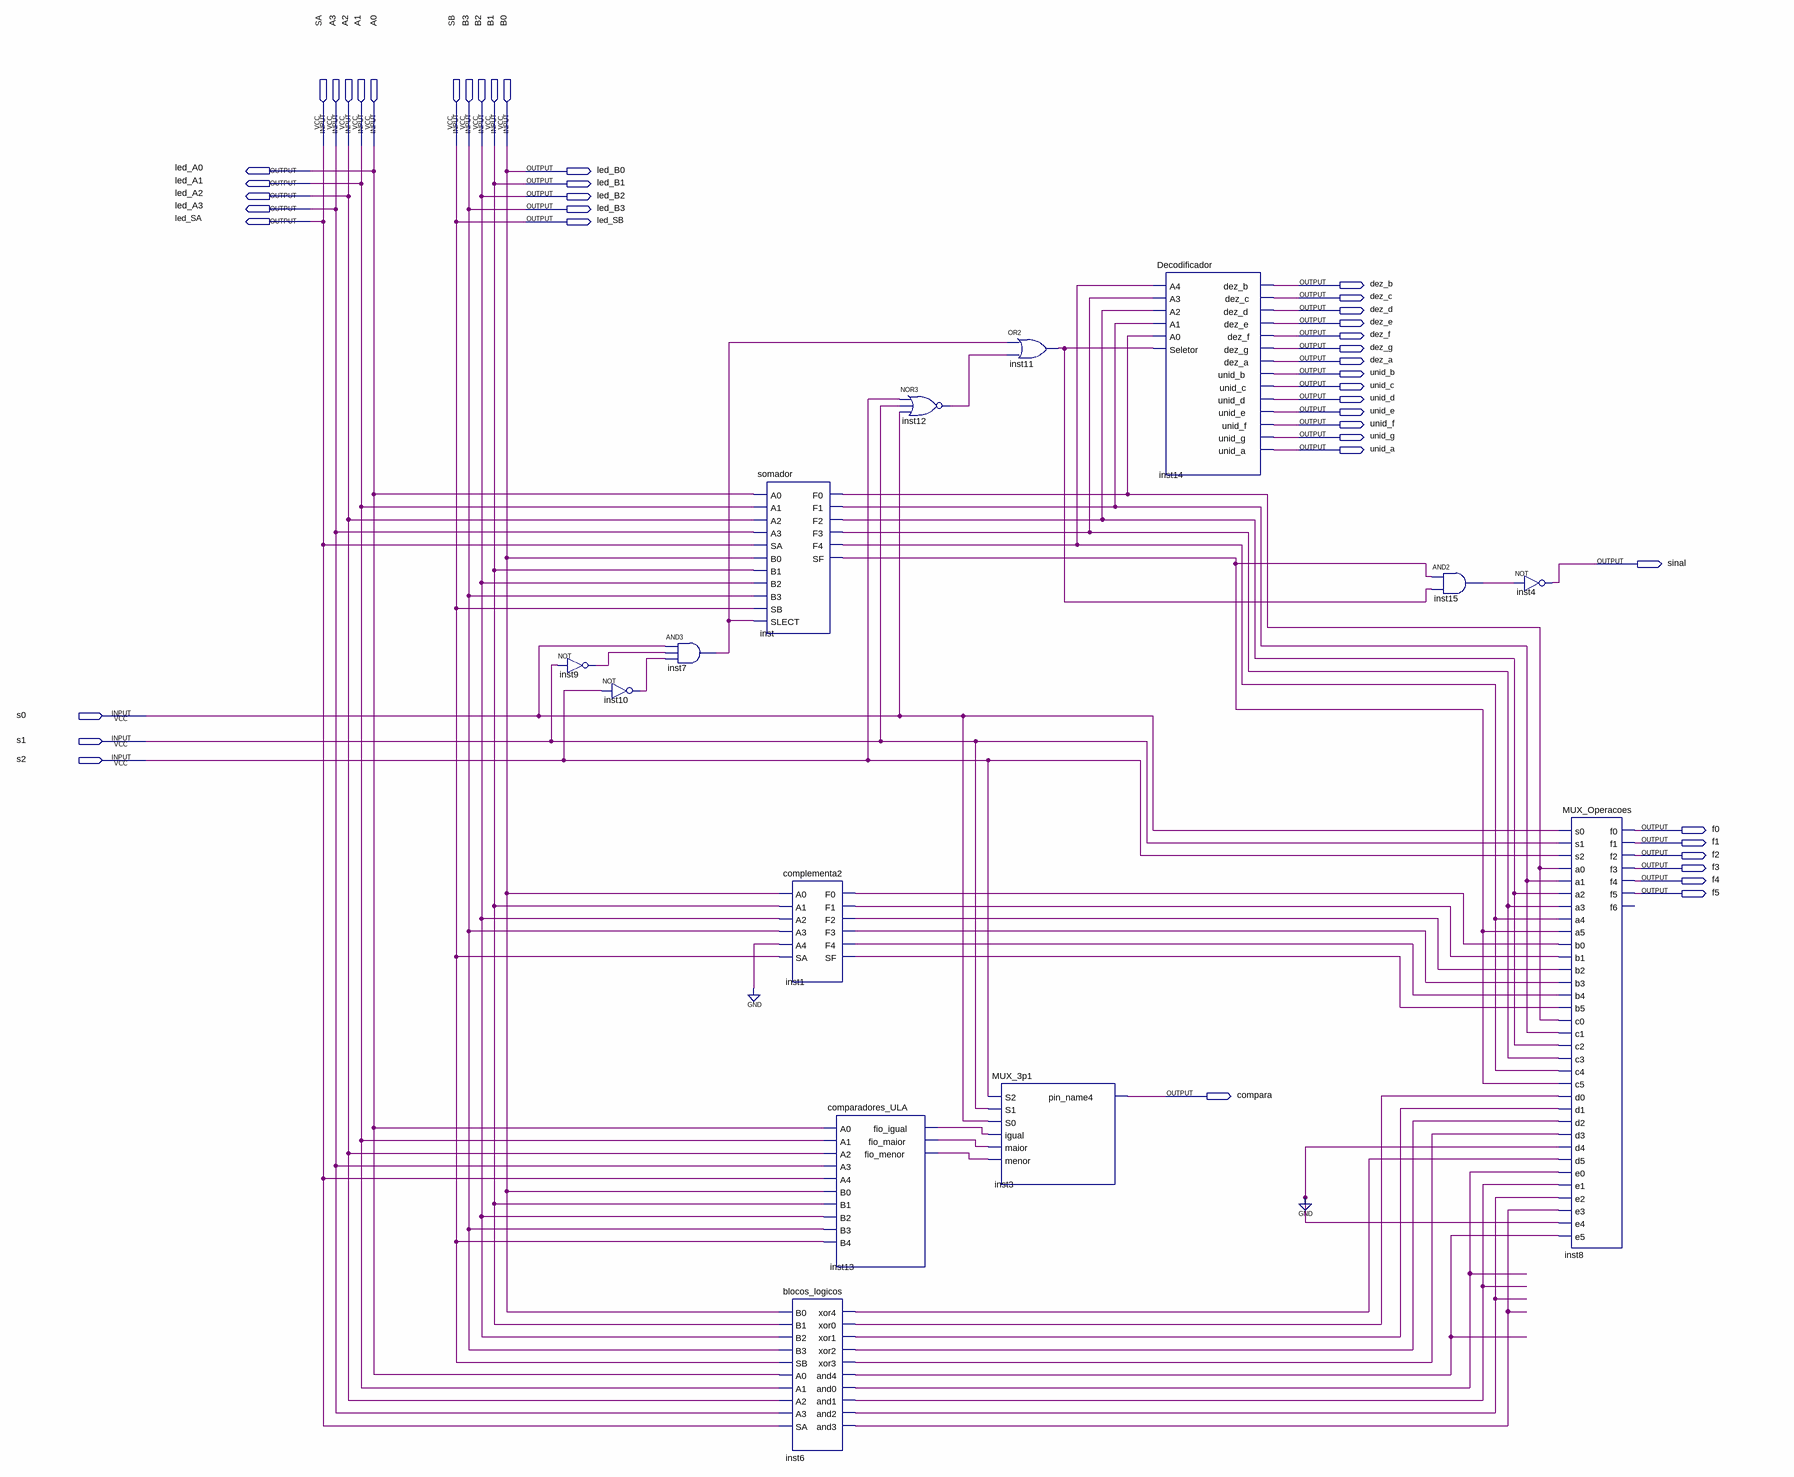
[diagram p0: schematic sheet]
// Quartus schematic circuito_completo.bdf as structural Verilog: 14 symbols, 45 pins
module circuito_completo (
  input  SA,
  input  A3,
  input  A2,
  input  A1,
  input  A0,
  input  SB,
  input  B3,
  input  B2,
  input  B1,
  input  B0,
  input  s0,
  input  s1,
  input  s2,
  output led_A0,
  output led_B0,
  output led_A1,
  output led_B1,
  output led_A2,
  output led_B2,
  output led_A3,
  output led_B3,
  output led_SA,
  output led_SB,
  output dez_b,
  output dez_c,
  output dez_d,
  output dez_e,
  output dez_f,
  output dez_g,
  output dez_a,
  output unid_b,
  output unid_c,
  output unid_d,
  output unid_e,
  output unid_f,
  output unid_g,
  output unid_a,
  output sinal,
  output f0,
  output f1,
  output f2,
  output f3,
  output f4,
  output f5,
  output compara
);

  wire inst1_f0, inst1_f1, inst1_f2, inst1_f3, inst1_f4, inst1_sf, inst6_and0, inst6_and1, inst6_and2,
       inst6_and3, inst6_and4, inst6_xor0, inst6_xor1, inst6_xor2, inst6_xor3, inst6_xor4, inst7_out,
       inst9_out, inst10_out, inst11_out, inst12_out, inst13_fio_igual, inst13_fio_maior, inst13_fio_menor,
       inst15_out, inst_f0, inst_f1, inst_f2, inst_f3, inst_f4, inst_sf;

  not inst9 (inst9_out, s1);
  not inst10 (inst10_out, s2);
  and inst7 (inst7_out, s0, inst9_out, inst10_out);
  somador inst (
    .A0(A0), .A1(A1), .A2(A2), .A3(A3), .SA(SA), .B0(B0), .B1(B1), .B2(B2), .B3(B3), .SB(SB),
    .SLECT(inst7_out), .F0(inst_f0), .F1(inst_f1), .F2(inst_f2), .F3(inst_f3), .F4(inst_f4), .SF(inst_sf));
  complementa2 inst1 (
    .A0(B0), .A1(B1), .A2(B2), .A3(B3), .A4(1'b0), .SA(SB), .F0(inst1_f0), .F1(inst1_f1), .F2(inst1_f2),
    .F3(inst1_f3), .F4(inst1_f4), .SF(inst1_sf));
  comparadores_ULA inst13 (
    .A0(A0), .A1(A1), .A2(A2), .A3(A3), .A4(SA), .B0(B0), .B1(B1), .B2(B2), .B3(B3), .B4(SB),
    .fio_igual(inst13_fio_igual), .fio_maior(inst13_fio_maior), .fio_menor(inst13_fio_menor));
  blocos_logicos inst6 (
    .B0(B0), .B1(B1), .B2(B2), .B3(B3), .SB(SB), .A0(A0), .A1(A1), .A2(A2), .A3(A3), .SA(SA),
    .xor4(inst6_xor4), .xor0(inst6_xor0), .xor1(inst6_xor1), .xor2(inst6_xor2), .xor3(inst6_xor3),
    .and4(inst6_and4), .and0(inst6_and0), .and1(inst6_and1), .and2(inst6_and2), .and3(inst6_and3));
  nor inst12 (inst12_out, s2, s1, s0);
  or inst11 (inst11_out, inst7_out, inst12_out);
  MUX_3p1 inst3 (
    .S2(s2), .S1(s1), .S0(s0), .igual(inst13_fio_igual), .maior(inst13_fio_maior), .menor(inst13_fio_menor),
    .pin_name4(compara));
  Decodificador inst14 (
    .A4(inst_f4), .A3(inst_f3), .A2(inst_f2), .A1(inst_f1), .A0(inst_f0), .Seletor(inst11_out),
    .dez_b(dez_b), .dez_c(dez_c), .dez_d(dez_d), .dez_e(dez_e), .dez_f(dez_f), .dez_g(dez_g), .dez_a(dez_a),
    .unid_b(unid_b), .unid_c(unid_c), .unid_d(unid_d), .unid_e(unid_e), .unid_f(unid_f), .unid_g(unid_g),
    .unid_a(unid_a));
  and inst15 (inst15_out, inst_sf, inst11_out);
  not inst4 (sinal, inst15_out);
  MUX_Operacoes inst8 (
    .s0(s0), .s1(s1), .s2(s2), .a0(inst_f0), .a1(inst_f1), .a2(inst_f2), .a3(inst_f3), .a4(inst_f4),
    .a5(inst_sf), .b0(inst1_f0), .b1(inst1_f1), .b2(inst1_f2), .b3(inst1_f3), .b4(inst1_f4), .b5(inst1_sf),
    .c0(inst_f0), .c1(inst_f1), .c2(inst_f2), .c3(inst_f3), .c4(inst_f4), .c5(inst_sf), .d0(inst6_xor0),
    .d1(inst6_xor1), .d2(inst6_xor2), .d3(inst6_xor3), .d4(1'b0), .d5(inst6_xor4), .e0(inst6_and0),
    .e1(inst6_and1), .e2(inst6_and2), .e3(inst6_and3), .e4(1'b0), .e5(inst6_and4), .f0(f0), .f1(f1), .f2(f2),
    .f3(f3), .f4(f4), .f5(f5));  // open: f6

  assign led_A0 = A0;
  assign led_A1 = A1;
  assign led_A2 = A2;
  assign led_A3 = A3;
  assign led_B0 = B0;
  assign led_B1 = B1;
  assign led_B2 = B2;
  assign led_B3 = B3;
  assign led_SA = SA;
  assign led_SB = SB;
endmodule
